# EAGLE design vrnding-mechine (EAGLE 9.2.2)
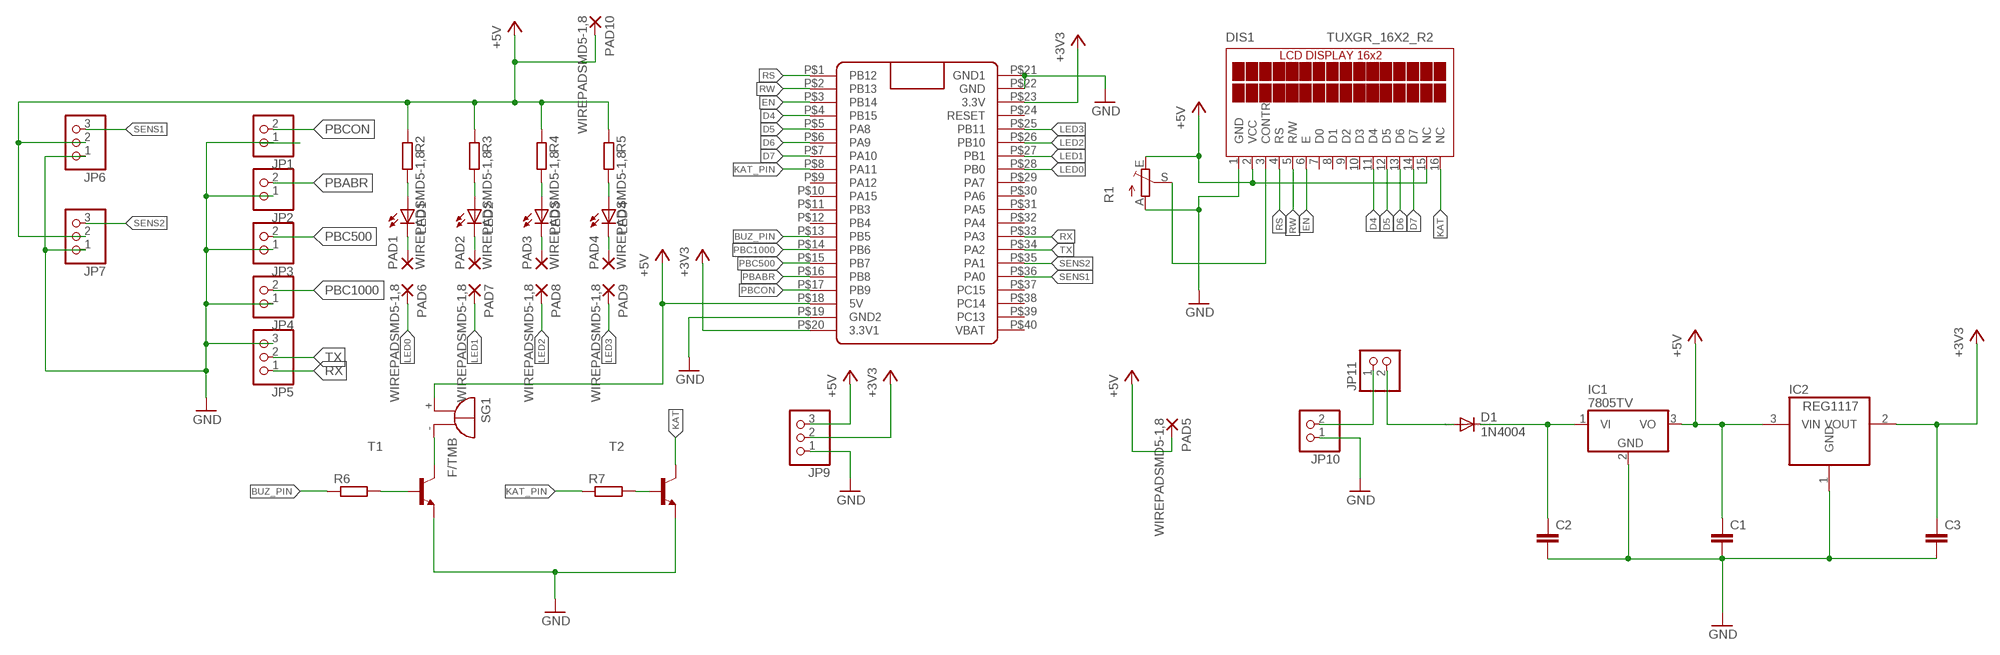
[diagram p0: schematic, sheet 1]

## Parts
C1  C-EU025-030X050  [C025-030X050]
C2  C-EU025-030X050  [C025-030X050]
C3  C-EU025-030X050  [C025-030X050]
D1  1N4004  [DO41-10]
DIS1  TUXGR_16X2_R2  [TUXGR_16X2_R2]
IC1  7805TV  [TO220V]
IC2  REG1117  [SOT223]
JP1  PINHD-1X2  [1X02]
JP2  PINHD-1X2  [1X02]
JP3  PINHD-1X2  [1X02]
JP4  PINHD-1X2  [1X02]
JP5  PINHD-1X3  [1X03]
JP6  PINHD-1X3  [1X03]
JP7  PINHD-1X3  [1X03]
JP9  PINHD-1X3  [1X03]
JP10  PINHD-1X2  [1X02]
JP11  PINHD-1X2  [1X02]
LED1  LED5MM  [LED5MM]
LED2  LED5MM  [LED5MM]
LED3  LED5MM  [LED5MM]
LED4  LED5MM  [LED5MM]
PAD1  WIREPADSMD5-1,8  [5-1,8]
PAD2  WIREPADSMD5-1,8  [5-1,8]
PAD3  WIREPADSMD5-1,8  [5-1,8]
PAD4  WIREPADSMD5-1,8  [5-1,8]
PAD5  WIREPADSMD5-1,8  [5-1,8]
PAD6  WIREPADSMD5-1,8  [5-1,8]
PAD7  WIREPADSMD5-1,8  [5-1,8]
PAD8  WIREPADSMD5-1,8  [5-1,8]
PAD9  WIREPADSMD5-1,8  [5-1,8]
PAD10  WIREPADSMD5-1,8  [5-1,8]
R1  TRIM_EU-CA6V  [CA6V]
R2  R-EU_0309/10  [0309/10]
R3  R-EU_0309/10  [0309/10]
R4  R-EU_0309/10  [0309/10]
R5  R-EU_0309/10  [0309/10]
R6  R-EU_0309/10  [0309/10]
R7  R-EU_0309/10  [0309/10]
SG1  F/TMB  [F/TMB]
T1  -NPN-TO92-ECB  [TO92-ECB]
T2  -NPN-TO92-ECB  [TO92-ECB]
U$1  BLUE_PILL  [BLUE_PILL]

## Nets
+3V3: C3.1 IC2.2(VOUT) JP9.2 U$1.P$20(3.3V1) U$1.P$23(3.3V)
+5V: C1.1 DIS1.2(VCC) DIS1.15(NC) IC1.3(VO) IC2.3(VIN) JP6.2 JP7.2 JP9.3 PAD5.1(P) PAD10.1(P) R1.E R2.1 R3.1 R4.1 R5.1 SG1.+ U$1.P$18(5V)
BUZ_PIN: R6.1 U$1.P$13(PB5)
D4: DIS1.11(D4) U$1.P$4(PB15)
D5: DIS1.12(D5) U$1.P$5(PA8)
D6: DIS1.13(D6) U$1.P$6(PA9)
D7: DIS1.14(D7) U$1.P$7(PA10)
EN: DIS1.6(E) U$1.P$3(PB14)
GND: C1.2 C2.2 C3.2 DIS1.1(GND) IC1.2(GND) IC2.1(GND) JP1.1 JP2.1 JP3.1 JP4.1 JP5.3 JP6.1 JP7.1 JP9.1 JP10.1 R1.A T1.E T2.E U$1.P$19(GND2) U$1.P$21(GND1) U$1.P$22(GND)
KAT: DIS1.16(NC) T2.C
KAT_PIN: R7.1 U$1.P$8(PA11)
LED0: PAD6.1(P) U$1.P$28(PB0)
LED1: PAD7.1(P) U$1.P$27(PB1)
LED2: PAD8.1(P) U$1.P$26(PB10)
LED3: PAD9.1(P) U$1.P$25(PB11)
N$1: DIS1.3(CONTR) R1.S
N$2: SG1.- T1.C
N$3: R6.2 T1.B
N$4: LED1.A R2.2
N$5: LED2.A R3.2
N$6: LED3.A R4.2
N$7: LED4.A R5.2
N$8: R7.2 T2.B
N$9: LED2.K(C) PAD2.1(P)
N$10: LED1.K(C) PAD1.1(P)
N$11: LED3.K(C) PAD3.1(P)
N$12: LED4.K(C) PAD4.1(P)
N$13: JP10.2 JP11.1
N$14: D1.A JP11.2
N$15: C2.1 D1.C IC1.1(VI)
PBABR: JP2.2 U$1.P$16(PB8)
PBC500: JP3.2 U$1.P$15(PB7)
PBC1000: JP4.2 U$1.P$14(PB6)
PBCON: JP1.2 U$1.P$17(PB9)
RS: DIS1.4(RS) U$1.P$1(PB12)
RW: DIS1.5(R/W) U$1.P$2(PB13)
RX: JP5.1 U$1.P$33(PA3)
SENS1: JP6.3 U$1.P$36(PA0)
SENS2: JP7.3 U$1.P$35(PA1)
TX: JP5.2 U$1.P$34(PA2)
Unconnected: DIS1.7(D0) DIS1.8(D1) DIS1.9(D2) DIS1.10(D3) U$1.P$9(PA12) U$1.P$10(PA15) U$1.P$11(PB3) U$1.P$12(PB4) U$1.P$24(RESET) U$1.P$29(PA7) U$1.P$30(PA6) U$1.P$31(PA5) U$1.P$32(PA4) U$1.P$37(PC15) U$1.P$38(PC14) U$1.P$39(PC13) U$1.P$40(VBAT)

## Library data of the parts
C1-C3 = rcl:C-EU: CAPACITOR, European symbol; SPICEPREFIX: C
D1 = diode:1N4004: DIODE general purpose rectifier, 1 A
DIS1 = display-lcd:TUXGR_16X2_R2: Tuxgraphics LCD display 16x2 characters reflective, without background light Source: tuxgr_12x2_r2.pdf; OC_FARNELL: unknown; OC_NEWARK: unknown
IC1 = linear:78*: Positive VOLTAGE REGULATOR Source: http://cache.national.com/ds/LM/LM78L05.pdf http://www.fairchildsemi.com/ds/LM/LM7805.pdf
IC2 = burr-brown:REG1117: 800mA and 1A Low Dropout (LDO) Positive Regulator 1.8V, 2.5V, 2.85V, 3.3V, 5V, and Adj; MPN: REG1117; OC_FARNELL: 1097566; OC_NEWARK: 14P6981
JP1-JP4 JP10 JP11 = pinhead:PINHD-1X2: PIN HEADER
JP5-JP7 JP9 = pinhead:PINHD-1X3: PIN HEADER
LED1-LED4 = led:LED: LED OSRAM: - CHIPLED LG R971, LG N971, LY N971, LG Q971, LY Q971, LO R971, LY R971 LH N974, LH R974 LS Q976, LO Q976, LY Q976 LO Q996 - Hyper CHIPLED LW Q18S LB Q993, LB Q99A, LB R99A - SideLED LS A670, LO A670, LY A670, LG A670, LP A670 LB A673, LV A673, LT A673, LW A673 LH A674 LY A675 LS A676, LA A676, LO A676, LY A676, LW A676 LS A679, LY A679, LG A679 - Hyper Micro SIDELED® LS Y876, LA Y876, LO Y876, LY Y876 LT Y87S - SmartLED LW L88C, LW L88S LB L89C, LB L89S, LG L890 LS L89K, LO L89K, LY L89K LS L896, LA L896, LO L896, LY L896 - TOPLED LS T670, LO T670, LY T670, LG T670, LP T670 LSG T670, LSP T670, LSY T670, LOP T670, LYG T670 LG T671, LOG T671, LSG T671 LB T673, LV T673, LT T673, LW T673 LH T674 LS T676, LA T676, LO T676, LY T676, LB T676, LH T676, LSB T676, LW T676 LB T67C, LV T67C, LT T67C, LS T67K, LO T67K, LY T67K, LW E67C LS E67B, LA E67B, LO E67B, LY E67B, LB E67C, LV E67C, LT E67C LW T67C LS T679, LY T679, LG T679 LS T770, LO T770, LY T770, LG T770, LP T770 LB T773, LV T773, LT T773, LW T773 LH T774 LS E675, LA E675, LY E675, LS T675 LS T776, LA T776, LO T776, LY T776, LB T776 LHGB T686 LT T68C, LB T68C - Hyper Mini TOPLED® LB M676 - Mini TOPLED Santana® LG M470 LS M47K, LO M47K, LY M47K Source: http://www.osram.convergy.de LUXEON: - LUMILED® LXK2-PW12-R00, LXK2-PW12-S00, LXK2-PW14-U00, LXK2-PW14-V00 LXK2-PM12-R00, LXK2-PM12-S00, LXK2-PM14-U00 LXK2-PE12-Q00, LXK2-PE12-R00, LXK2-PE12-S00, LXK2-PE14-T00, LXK2-PE14-U00 LXK2-PB12-K00, LXK2-PB12-L00, LXK2-PB12-M00, LXK2-PB14-N00, LXK2-PB14-P00, LXK2-PB14-Q00 LXK2-PR12-L00, LXK2-PR12-M00, LXK2-PR14-Q00, LXK2-PR14-R00 LXK2-PD12-Q00, LXK2-PD12-R00, LXK2-PD12-S00 LXK2-PH12-R00, LXK2-PH12-S00 LXK2-PL12-P00, LXK2-PL12-Q00, LXK2-PL12-R00 Source: www.luxeon.com KINGBRIGHT: KA-3528ASYC Source: www.kingbright.com
PAD1-PAD10 = wirepad:WIREPAD: Wire PAD connect wire on PCB
R1 = pot:TRIM_EU-: POTENTIOMETER
R2-R7 = rcl:R-EU_: RESISTOR, European symbol; SPICEPREFIX: R
SG1 = buzzer:F/TMB: BUZZER Source: Buerklin; OC_FARNELL: unknown; OC_NEWARK: unknown
T1 T2 = transistor:*-NPN-: NPN Transistror BF959 corrected 2008.03.06
U$1 = BluePill:BLUE_PILL

## Board
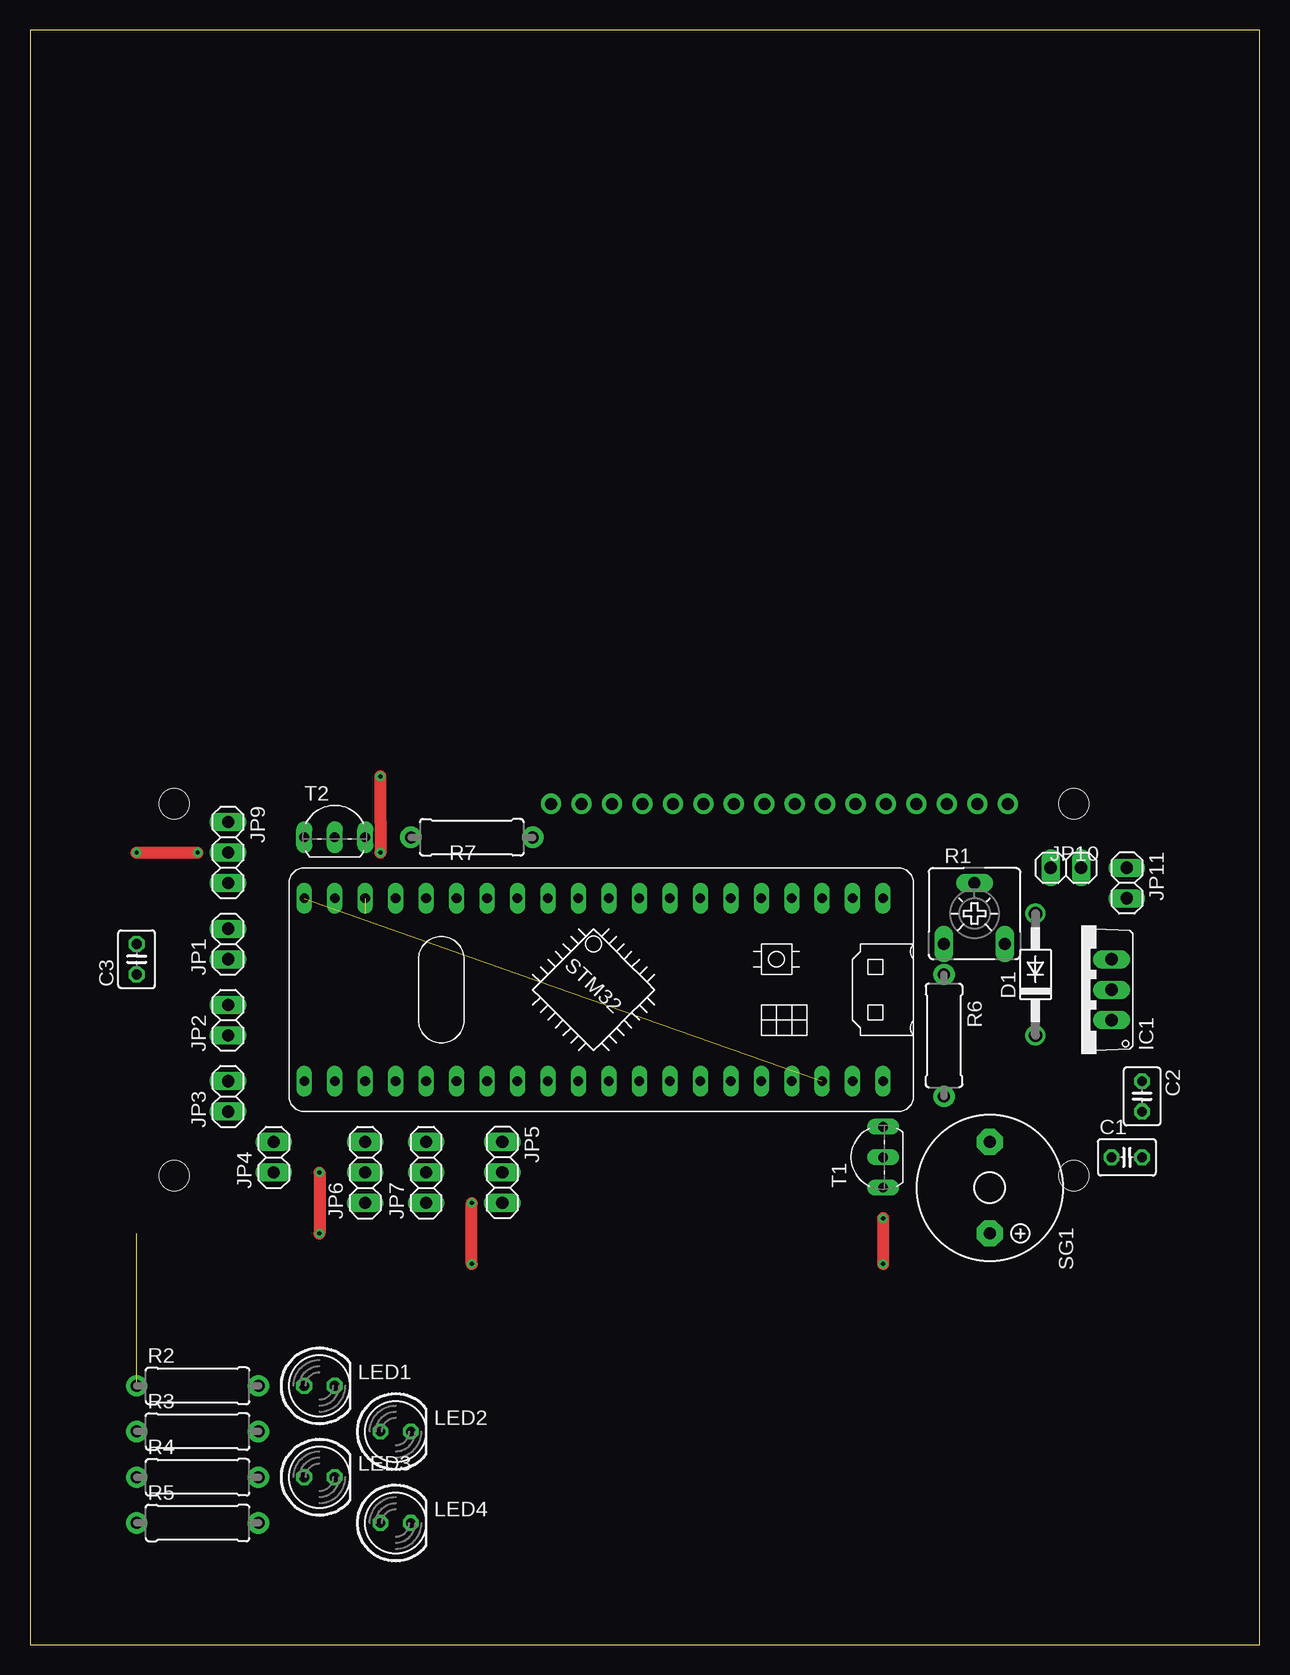
[diagram p1: board, top side]
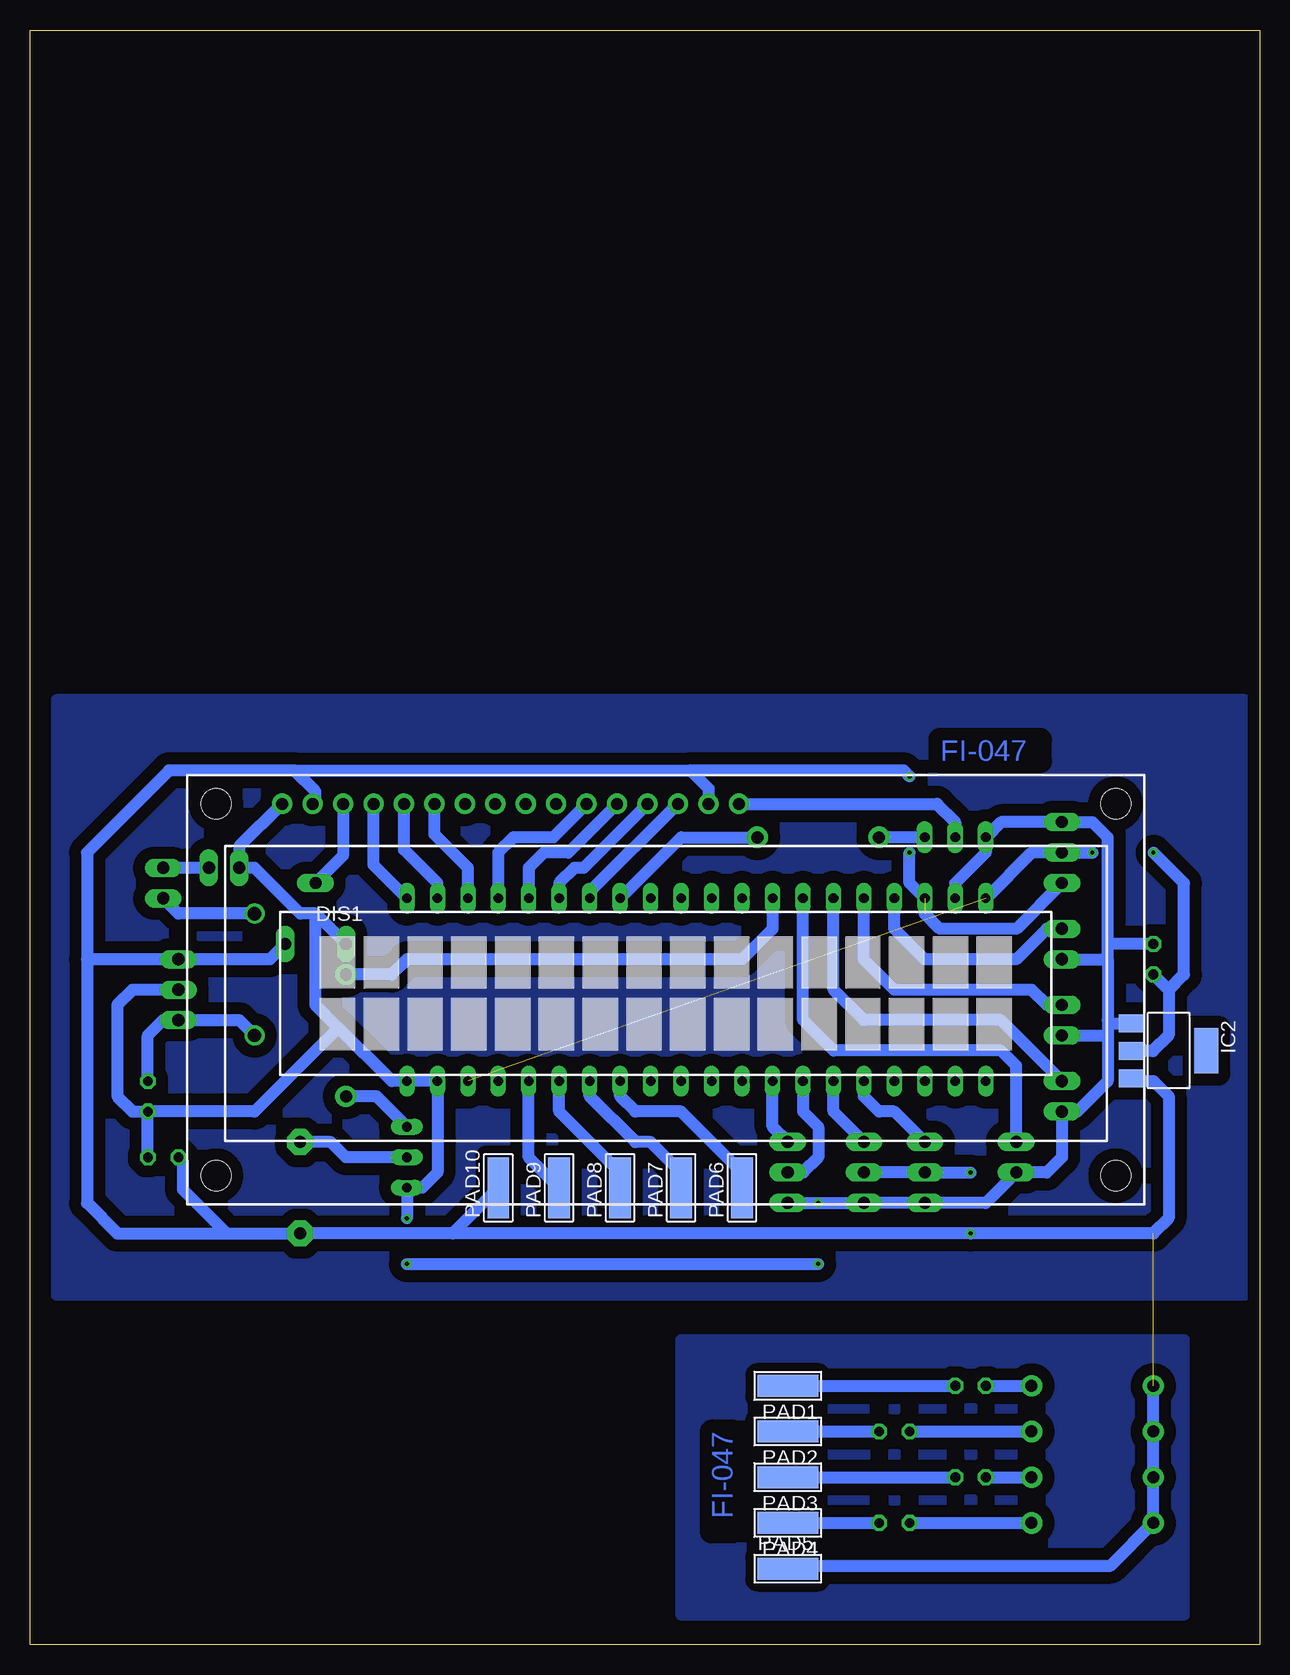
[diagram p2: board, bottom side, seen from below]

Size 102.54 x 134.61 mm. Coordinates in mm from the lower left corner, seen from the top.
Outline: 0,0 102.54,0 102.54,134.61 0,134.61 0,0
Copper layers (1*16): Top 0.035mm / dielectric 1.5mm / Bottom 0.035mm
Design rules "default": minimum track width 6mil, minimum drill 0.35mm, track to track 6mil, track to pad 6mil, pad to pad 6mil, via to via 6mil, smd to smd 6mil, copper to edge 40mil, drill to drill 6mil, minimum pad ring 10mil, minimum via ring 8mil, stop-mask expansion 4mil, vias tented up to drill 0mil, thermal gap 10mil

### Footprints (pad centres in the part's own frame; a part is rotated, then mirrored left to right if it is on the bottom)
C025-030X050 = drill 0.813 octagon: 1 -1.27,0; 2 1.27,0
DO41-10 = drill 1.118: A 5.08,0; C -5.08,0
TUXGR_16X2_R2 = drill 1 pad 1.676: 1 -32,15.5; 2 -29.46,15.5; 3 -26.92,15.5; 4 -24.38,15.5; 5 -21.84,15.5; 6 -19.3,15.5; 7 -16.76,15.5; 8 -14.22,15.5; 9 -11.68,15.5; 10 -9.14,15.5; 11 -6.6,15.5; 12 -4.06,15.5; 13 -1.52,15.5; 14 1.02,15.5; 15 3.56,15.5; 16 6.1,15.5 | hole 2.5: -37.5,-15.5; 37.5,-15.5; -37.5,15.5; 37.5,15.5
TO220V = drill 1.016 long: 1 -2.54,-2.54; 2 0,-2.54; 3 2.54,-2.54
SOT223 = smd 1.499 x 2.007: 1 -2.261,-3.15; 2 0.025,-3.15; 3 2.311,-3.15 | smd 3.81 x 2.007: 4 0,3.15
1X02 = drill 1.016 long: 1 -1.27,0; 2 1.27,0
1X03 = drill 1.016 long: 1 -2.54,0; 2 0,0; 3 2.54,0
LED5MM = drill 0.813 octagon: A -1.27,0; K 1.27,0
5-1,8 = smd 1.829 x 5.08: 1 0,0
CA6V = drill 1.016 long: A -2.54,-2.54; E 2.54,-2.54; S 0,2.54
0309/10 = drill 1 pad 1.778: 1 -5.08,0; 2 5.08,0
F/TMB = drill 1.016 pad 2.159 octagon: + 3.81,0; - -3.81,0
TO92-ECB = drill 0.813 long: B 2.54,0; C 0,0; E -2.54,0
BLUE_PILL = drill 0.8 long: P$1 -7.62,15.24; P$2 -7.62,12.7; P$3 -7.62,10.16; P$4 -7.62,7.62; P$5 -7.62,5.08; P$6 -7.62,2.54; P$7 -7.62,0; P$8 -7.62,-2.54; P$9 -7.62,-5.08; P$10 -7.62,-7.62; P$11 -7.62,-10.16; P$12 -7.62,-12.7; P$13 -7.62,-15.24; P$14 -7.62,-17.78; P$15 -7.62,-20.32; P$16 -7.62,-22.86; P$17 -7.62,-25.4; P$18 -7.62,-27.94; P$19 -7.62,-30.48; P$20 -7.62,-33.02; P$21 7.62,15.24; P$22 7.62,12.7; P$23 7.62,10.16; P$24 7.62,7.62; P$25 7.62,5.08; P$26 7.62,2.54; P$27 7.62,0; P$28 7.62,-2.54; P$29 7.62,-5.08; P$30 7.62,-7.62; P$31 7.62,-10.16; P$32 7.62,-12.7; P$33 7.62,-15.24; P$34 7.62,-17.78; P$35 7.62,-20.32; P$36 7.62,-22.86; P$37 7.62,-25.4; P$38 7.62,-27.94; P$39 7.62,-30.48; P$40 7.62,-33.02

### Placement (x,y rotation side)
C1  91.44,40.64 0 top
C2  92.71,45.72 270 top
C3  8.89,57.15 90 top
D1  83.82,55.88 90 top
DIS1  49.53,54.61 0 bottom
IC1  87.63,54.61 90 top
IC2  7.62,49.53 270 bottom
JP1  16.51,58.42 90 top
JP2  16.51,52.07 90 top
JP3  16.51,45.72 90 top
JP4  20.32,40.64 90 top
JP5  39.37,39.37 270 top
JP6  27.94,39.37 90 top
JP7  33.02,39.37 90 top
JP9  16.51,66.04 270 top
JP10  86.36,64.77 0 top
JP11  91.44,63.5 270 top
LED1  24.13,21.59 0 top
LED2  30.48,17.78 0 top
LED3  24.13,13.97 0 top
LED4  30.48,10.16 0 top
PAD1  39.37,21.59 90 bottom
PAD2  39.37,17.78 90 bottom
PAD3  39.37,13.97 90 bottom
PAD4  39.37,10.16 90 bottom
PAD5  39.37,6.35 270 bottom
PAD6  43.18,38.1 0 bottom
PAD7  48.26,38.1 0 bottom
PAD8  53.34,38.1 0 bottom
PAD9  58.42,38.1 0 bottom
PAD10  63.5,38.1 0 bottom
R1  78.74,60.96 0 top
R2  13.97,21.59 0 top
R3  13.97,17.78 0 top
R4  13.97,13.97 0 top
R5  13.97,10.16 0 top
R6  76.2,50.8 270 top
R7  36.83,67.31 180 top
SG1  80.01,38.1 270 top
T1  71.12,40.64 90 top
T2  25.4,67.31 0 top
U$1  55.88,54.61 270 top

### Tracks (layer width: path | path; a pad name or v marks a point on that pad's centre or on a via)
+3V3  (via drill 0.35)  (1 unrouted)
  Top 1.016: v8.89,66.04 v13.97,66.04
  Bottom 1.016: C3.1 7.62,54.61 | 7.62,54.61 7.62,50.8 8.91,49.51 IC2.2 | U$1.P$20 19.05,66.04 JP9.2 v13.97,66.04 | 7.62,54.61 6.35,55.88 6.35,63.5 v8.89,66.04
+5V  (via drill 0.35)  (2 unrouted)
  Top 1.016: v24.13,39.37 v24.13,34.29 | v29.21,66.04 29.21,66.05 29.26,66.1 29.26,68.52 29.21,68.57 v29.21,72.39
  Bottom 1.016: R2.1 R3.1 R4.1 R5.1 12.45,6.6 39.12,6.6 PAD5.1 | JP7.2 JP6.2 v24.13,39.37 | PAD10.1 67.31,34.29 | 67.31,34.29 SG1.+ 86.13,34.29 | C1.1 89.8,40.27 89.8,37.96 86.13,34.29 | R1.E 82.55,57.15 IC1.3 97.79,57.15 | IC2.3 10.54,46.99 8.89,46.99 7.62,45.72 7.62,35.56 8.89,34.29 v24.13,34.29 67.31,34.29 | DIS1.2 78.74,70.36 78.74,71.12 80.5,72.88 | 80.5,72.88 90.95,72.88 97.79,66.04 97.79,57.15 | 86.13,34.29 95.25,34.29 97.79,36.83 97.79,57.15 | 80.5,72.88 47.48,72.88 | DIS1.15 45.97,71.37 47.48,72.88 | 27.94,60.96 26.67,59.69 20.32,59.69 JP9.3 | 47.48,72.88 29.7,72.88 v29.21,72.39 | U$1.P$18 29.21,63.5 v29.21,66.04
BUZ_PIN
  Bottom 1.016: U$1.P$13 40.64,59.69 43.18,57.15 71.12,57.15 72.39,55.88 R6.1
D4
  Bottom 1.016: DIS1.11 58.93,67.31 62.23,67.31 63.5,66.04 U$1.P$4
D5
  Bottom 1.016: DIS1.12 57.66,66.04 59.69,66.04 60.96,64.77 U$1.P$5
D6
  Bottom 1.016: DIS1.13 56.39,64.77 57.15,64.77 58.42,63.5 U$1.P$6
D7
  Bottom 1.016: DIS1.14 55.88,62.74 U$1.P$7
EN
  Bottom 1.016: DIS1.6 68.83,67.56 66.04,64.77 U$1.P$3
GND  (via drill 0.35)
  Top 1.016: v36.83,31.75 v36.83,36.83 | v71.12,35.56 v71.12,31.75
  Bottom 1.016: U$1.P$19 25.4,63.5 22.86,66.04 T2.E 21.59,68.58 JP9.1 13.97,68.58 12.7,67.31 12.7,58.42 | JP1.1 12.7,57.15 | 12.7,57.15 12.7,58.42 | C3.2 12.7,58.42 | 12.7,57.15 12.7,52.07 | 12.7,52.07 12.7,50.8 | 12.7,50.8 12.7,46.99 15.24,44.45 JP3.1 16.51,40.64 17.78,39.37 JP4.1 22.86,36.83 JP6.1 JP7.1 v36.83,36.83 JP5.3 | 12.7,52.07 12.42,51.79 IC2.1 | JP2.1 12.7,50.8 | C1.2 C2.2 | R1.A 78.74,60.96 | 78.74,60.96 80.01,60.96 83.82,64.77 JP10.1 85.09,66.55 DIS1.1 | 76.83,51.44 72.39,46.99 U$1.P$21 U$1.P$22 68.58,39.37 69.85,38.1 T1.E v71.12,35.56 | 76.83,51.44 78.74,53.34 78.74,60.96 | IC1.2 93.98,54.61 95.25,53.34 95.25,45.72 93.98,44.45 C2.2 | 76.83,51.44 83.82,44.45 C2.2 | v71.12,31.75 v36.83,31.75
KAT
  Bottom 1.016: DIS1.16 26.93,70.11 25.4,68.58 T2.C
KAT_PIN
  Bottom 1.016: R7.1 48.26,67.31 U$1.P$8
LED0
  Bottom 1.016: PAD6.1 43.18,39.37 48.26,44.45 52.07,44.45 53.34,45.72 U$1.P$28
LED1
  Bottom 1.016: PAD7.1 48.26,39.37 50.8,41.91 52.07,41.91 55.88,45.72 U$1.P$27
LED2
  Bottom 1.016: PAD8.1 53.34,39.37 58.42,44.45 U$1.P$26
LED3
  Bottom 1.016: PAD9.1 60.96,40.64 U$1.P$25
N$1
  Bottom 1.016: DIS1.3 76.45,65.79 R1.S
N$2
  Bottom 1.016: T1.C 76.2,40.64 77.47,41.91 SG1.-
N$3
  Bottom 1.016: T1.B 73.66,45.72 R6.2
N$4
  Bottom 1.016: LED1.A R2.2
N$5
  Bottom 1.016: LED2.A R3.2
N$6
  Bottom 1.016: LED3.A R4.2
N$7
  Bottom 1.016: LED4.A R5.2
N$8
  Bottom 1.016: T2.B R7.2
N$9
  Bottom 1.016: PAD2.1 LED2.K
N$10
  Bottom 1.016: PAD1.1 LED1.K
N$11
  Bottom 1.016: PAD3.1 LED3.K
N$12
  Bottom 1.016: PAD4.1 LED4.K
N$13
  Bottom 1.016: JP10.2 JP11.1
N$14
  Bottom 1.016: D1.A 90.17,60.96 JP11.2
N$15
  Bottom 1.016: C2.1 92.71,50.8 91.44,52.07 IC1.1 85.09,52.07 D1.C
PBABR
  Bottom 1.016: JP2.2 17.78,53.34 19.05,54.61 30.48,54.61 33.02,57.15 U$1.P$16
PBC500
  Bottom 1.016: JP3.2 21.59,52.07 33.02,52.07 35.56,54.61 U$1.P$15
PBC1000
  Bottom 1.016: U$1.P$14 38.1,52.07 35.56,49.53 21.59,49.53 20.32,48.26 JP4.2
PBCON
  Bottom 1.016: JP1.2 17.78,59.69 20.32,57.15 27.94,57.15 30.48,59.69 U$1.P$17
RS
  Bottom 1.016: U$1.P$1 73.91,65.02 DIS1.4
RW
  Bottom 1.016: U$1.P$2 68.58,63.5 71.37,66.29 DIS1.5
RX
  Bottom 1.016: JP5.1 40.64,43.18 U$1.P$33
SENS1
  Bottom 1.016: JP6.3 30.48,44.45 31.75,44.45 33.02,45.72 U$1.P$36
SENS2
  Bottom 1.016: JP7.3 35.56,44.45 U$1.P$35
TX
  Bottom 1.016: U$1.P$34 38.1,44.45 36.83,43.18 36.83,40.64 38.1,39.37 JP5.2
VND
  pour Bottom (isolate 1): 6.35,25.4 48.26,25.4 48.26,3.81 48.26,2.54 6.35,2.54
  pour Bottom (isolate 1): 1.27,78.74 100.33,78.74 100.33,29.21 1.27,29.21

### Text on the board
Bottom: FI-047 | FI-047